# EAGLE schematic EEZ PSU post-regulator r4B45 (EAGLE 6.1)
Assembly variants: Farnell, TME

## Sheet 1 of 3
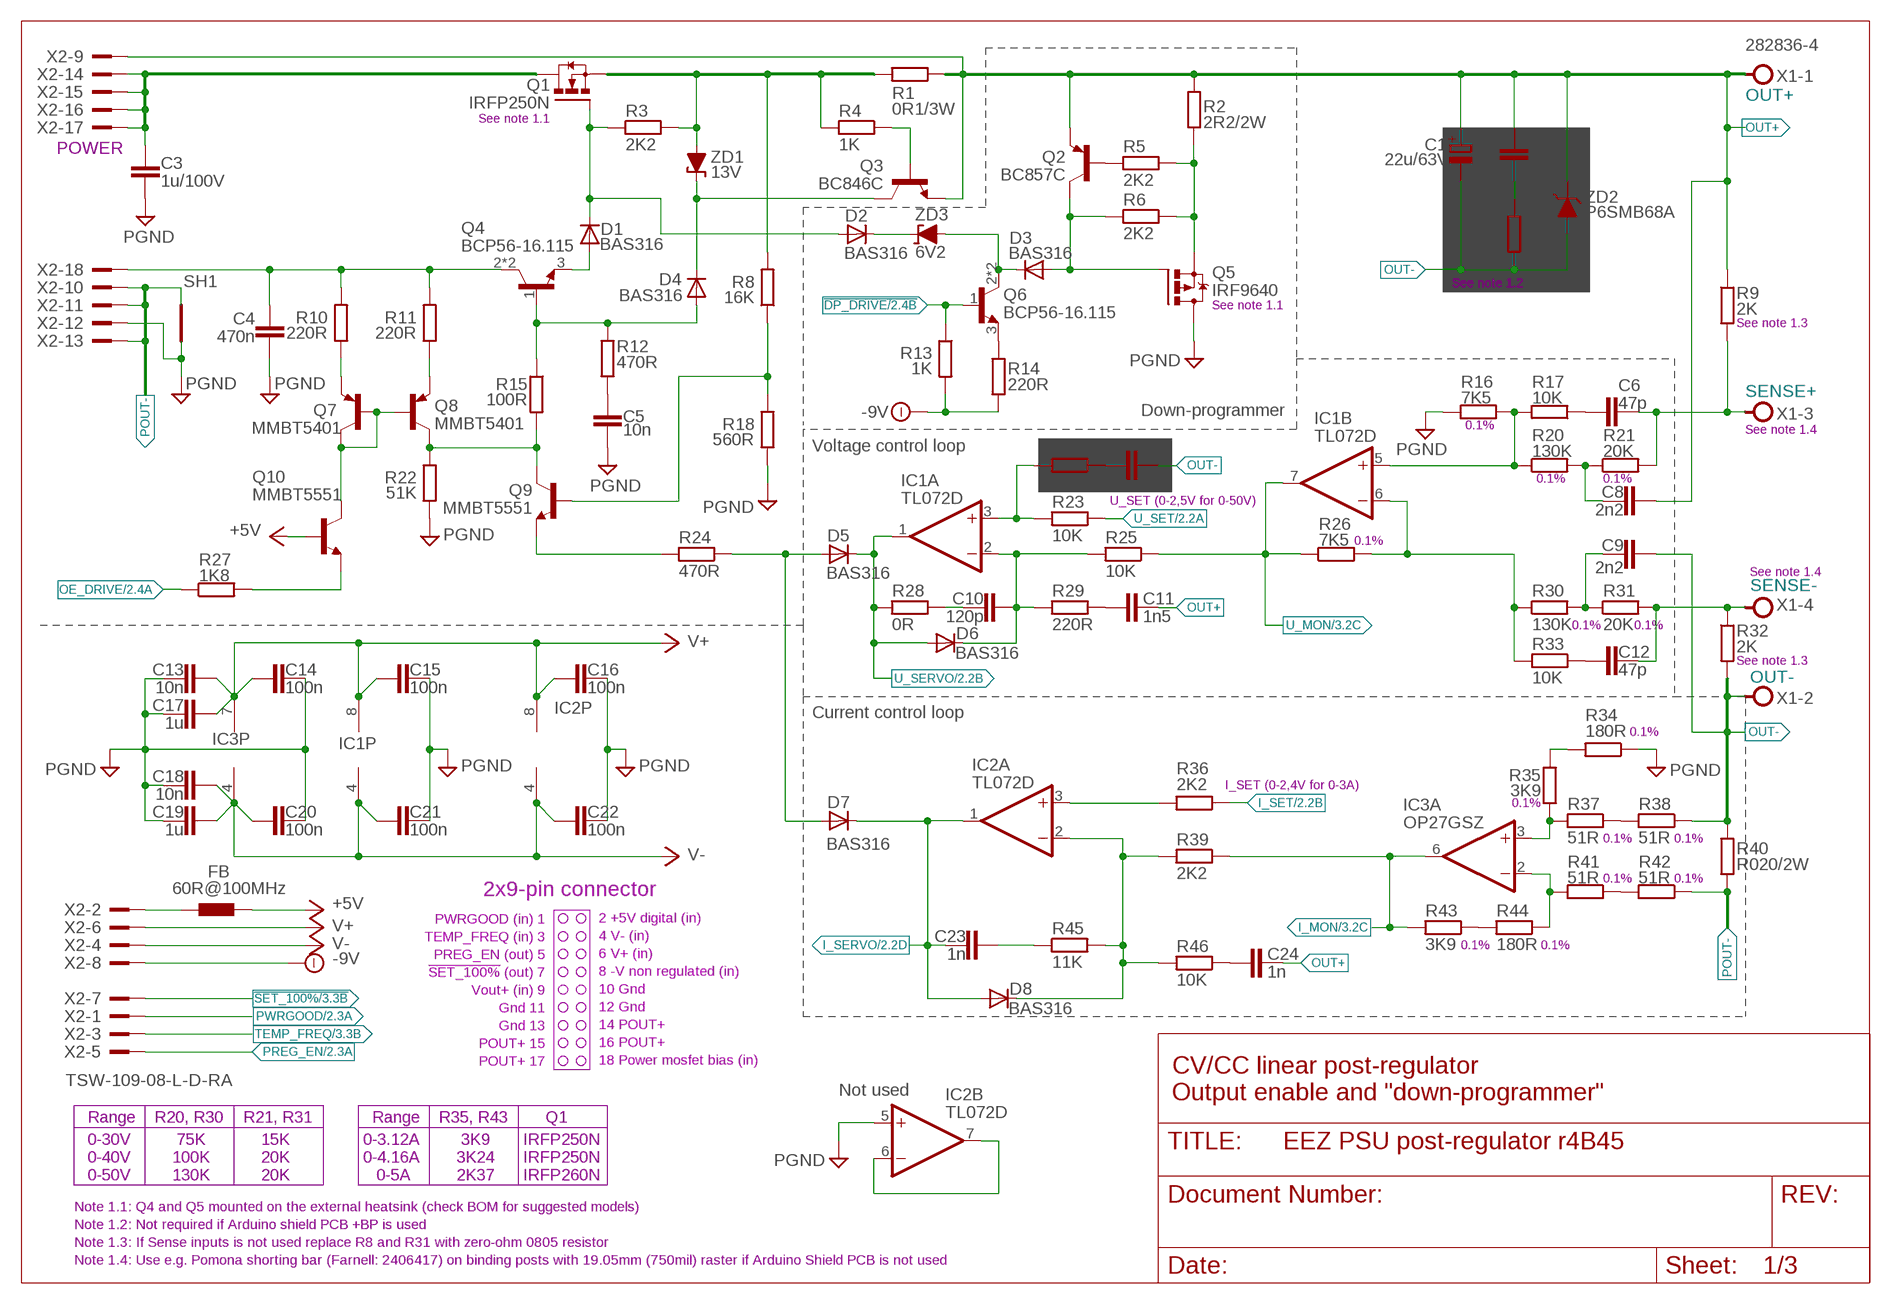
[diagram p0: schematic, sheet 1]

### Parts
C1  22u/63V  ECAPEEEFK+2.5MM  [CAPAE660X610N_COMBO2]
C2  470n  C-EUC1812  [C1812]
C3  1u/100V  C-EUC1206  [C1206]
C4  470n  C-EUC1812  [C1812]
C5  10n  C-EUC0805  [C0805]
C6  47p  C-EUC0805  [C0805]
C7  1n5  C-EUC0805  [C0805]
C8  2n2  C-EUC0805  [C0805]
C9  2n2  C-EUC0805  [C0805]
C10  120p  C-EUC0805  [C0805]
C11  1n5  C-EUC0805  [C0805]
C12  47p  C-EUC0805  [C0805]
C13  10n  C-EUC0805  [C0805]
C14  100n  C-EUC0603  [C0603]
C15  100n  C-EUC0603  [C0603]
C16  100n  C-EUC0603  [C0603]
C17  1u  C-EUC0805  [C0805]
C18  10n  C-EUC0805  [C0805]
C19  1u  C-EUC0805  [C0805]
C20  100n  C-EUC0603  [C0603]
C21  100n  C-EUC0603  [C0603]
C22  100n  C-EUC0603  [C0603]
C23  1n  C-EUC0805  [C0805]
C24  1n  C-EUC0805  [C0805]
D1  BAS316  DIODE-SOD323-W  [SOD323-W]
D2  BAS316  DIODE-SOD323-W  [SOD323-W]
D3  BAS316  DIODE-SOD323-W  [SOD323-W]
D4  BAS316  DIODE-SOD323-W  [SOD323-W]
D5  BAS316  DIODE-SOD323-W  [SOD323-W]
D6  BAS316  DIODE-SOD323-W  [SOD323-W]
D7  BAS316  DIODE-SOD323-W  [SOD323-W]
D8  BAS316  DIODE-SOD323-W  [SOD323-W]
FB  60R@100MHz  FERRITE_BEAD0603  [BEAD0603]
IC1  TL072D  TL072SOIC8  [SOIC127P600X173-8N]
IC2  TL072D  TL072SOIC8  [SOIC127P600X173-8N]
IC3  OP27GSZ  OP27GSZSO8  [SOIC127P600X173-8N]
Q1  IRFP250N  IRFP240  [TO247BV]
Q2  BC857C  BC857C-PNP-SOT23-BEC  [SOT23-BEC]
Q3  BC846C  BC846B-NPN-SOT23-BEC  [SOT23-BEC]
Q4  BCP56-16.115  BCP56  [SOT230P700X180-4N]
Q5  IRF9640  [TO220B-VMOS]
Q6  BCP56-16.115  BCP56  [SOT230P700X180-4N]
Q7  MMBT5401  BC857B-PNP-SOT23-BEC  [SOT23-BEC]
Q8  MMBT5401  BC857B-PNP-SOT23-BEC  [SOT23-BEC]
Q9  MMBT5551  MMBT5551LT1-NPN-SOT23-BEC  [SOT23-BEC]
Q10  MMBT5551  MMBT5551LT1-NPN-SOT23-BEC  [SOT23-BEC]
R1  0R1/3W  R-EU_0411/3V  [0411V]
R2  2R2/2W  R-EU_0411/3V  [0411V]
R3  2K2  R-EU_R0805  [R0805]
R4  1K  R-EU_R0805  [R0805]
R5  2K2  R-EU_R0805  [R0805]
R6  2K2  R-EU_R0805  [R0805]
R7  1R  R-EU_R0805  [R0805]
R8  16K  R-EU_R0805  [R0805]
R9  2K  R-EU_R0805  [R0805]
R10  220R  R-EU_R0805  [R0805]
R11  220R  R-EU_R0805  [R0805]
R12  470R  R-EU_R0805  [R0805]
R13  1K  R-EU_R0805  [R0805]
R14  220R  R-EU_R0805  [R0805]
R15  100R  R-EU_R0805  [R0805]
R16  7K5  R-EU_R0805  [R0805]
R17  10K  R-EU_R0805  [R0805]
R18  560R  R-EU_R0805  [R0805]
R19  220R  R-EU_R0805  [R0805]
R20  130K  R-EU_R0805  [R0805]
R21  20K  R-EU_R0805  [R0805]
R22  51K  R-EU_R0805  [R0805]
R23  10K  R-EU_R0805  [R0805]
R24  470R  R-EU_R0805  [R0805]
R25  10K  R-EU_R0805  [R0805]
R26  7K5  R-EU_R0805  [R0805]
R27  1K8  R-EU_R0805  [R0805]
R28  0R  R-EU_R0805  [R0805]
R29  220R  R-EU_R0805  [R0805]
R30  130K  R-EU_R0805  [R0805]
R31  20K  R-EU_R0805  [R0805]
R32  2K  R-EU_R0805  [R0805]
R33  10K  R-EU_R0805  [R0805]
R34  180R  R-EU_R0805  [R0805]
R35  3K9  R-EU_R0805  [R0805]
R36  2K2  R-EU_R0805  [R0805]
R37  51R  R-EU_R0805  [R0805]
R38  51R  R-EU_R0805  [R0805]
R39  2K2  R-EU_R0805  [R0805]
R40  R020/2W  R-EU_R2512  [R2512]
R41  51R  R-EU_R0805  [R0805]
R42  51R  R-EU_R0805  [R0805]
R43  3K9  R-EU_R0805  [R0805]
R44  180R  R-EU_R0805  [R0805]
R45  11K  R-EU_R0805  [R0805]
R46  10K  R-EU_R0805  [R0805]
SH1  GND  SHORT  [SHORT]
X1  282836-4  TBLOCK5.0_4A  [TBLOCK5.0_4]
X2  TSW-109-08-L-D-RA  [TSW-109-08-L-D-RA]
ZD1  13V  ZENER-DIODEMINIMELF  [MINIMELF]
ZD2  P6SMB68A  [DO214AA]
ZD3  6V2  ZENER-DIODEMINIMELF  [MINIMELF]

### Nets
!DP_DRIVE: Q6.1(B) R13.1 ; also sheet 2
!SET_100%: X2.7 ; also sheet 3
+5V: FB.P$2 Q10.B ; also sheet 2,3
-9V: R13.2 R14.2 X2.8
DC_IN: C3.1 Q1.D X2.14 X2.15 X2.16 X2.17
GND [gnd]: C3.2 C4.2 C5.2 C13.1 C14.2 C15.1 C16.1 C17.1 C18.1 C19.1 C20.2 C21.1 C22.1 IC2.5(B:+IN) Q5.D R16.1 R18.1 R22.1 R34.1 SH1.1(GND_A) X2.12 ; supply symbol labelled PGND ; also sheet 2,3
I_MON: IC3.6(A:OUT) R39.1 R43.2 ; also sheet 3
I_SERVO: C23.2 D7.C D8.A IC2.1(A:OUT) ; also sheet 2
I_SET: R36.1 ; also sheet 2
ISENSE+: IC3.3(A:+IN) R35.2 R37.2
ISENSE-: IC3.2(A:-IN) R41.2 R44.1
N$1: Q6.3(E) R14.1
N$2: Q2.B R5.2
N$3: C6.2 R17.1
N$8: R37.1 R38.2
N$10: C12.2 R33.1
N$12: FB.P$1 X2.2
N$13: R41.1 R42.2
N$14: R43.1 R44.2
N$15: R34.2 R35.1
N$16: IC2.6(B:-IN) IC2.7(B:OUT)
N$17: C9.1 R30.2 R31.1
N$18: C10.2 R28.1
N$22: C24.2 R46.1
N$26: C7.2 R19.1
N$27: C11.2 R29.1
N$29: IC1.3(A:+IN) R19.2 R23.2
N$32: C10.1 D6.C IC1.2(A:-IN) R25.2 R29.2
N$37: D8.C IC2.2(A:-IN) R39.2 R45.2 R46.2
N$44: Q9.B R8.1 R18.2
N$50: IC2.3(A:+IN) R36.2
N$54: D5.A D7.A R24.1
N$56: D1.C D2.A Q1.G R3.1
N$62: D1.A Q4.3(E)
N$65: D4.A Q4.1(B) R12.2 R15.1
N$67: C5.1 R12.1
N$117: C8.1 R20.2 R21.1
N$129: D4.C Q3.C ZD1.C
N$143: D2.C ZD3.C
N$145: Q9.E R24.2
N$146: Q5.S R2.1 R5.1 R6.1
N$147: D3.A Q2.C Q5.G R6.2
N$149: C2.2 R7.2
N$150: IC1.5(B:+IN) R16.2 R17.2 R20.1
N$158: IC1.6(B:-IN) R26.2 R30.1 R33.2
N$172: C23.1 R45.1
N$183: Q8.E R11.1
N$184: Q7.E R10.1
N$186: Q10.E R27.2
N$201: Q3.B R4.1
OE_DRIVE: R27.1 ; also sheet 2
OUT+: C1.1(+) C1.1.1(+) C2.1 C8.2 C11.1 C24.1 Q2.E Q3.E R1.1 R2.2 R9.1 X1.P$1 X2.9 ZD2.C
OUT-: C1.2(-) C1.2.1(-) C7.1 C9.2 R7.1 R32.2 R38.1 R40.1 X1.P$2 ZD2.A
POUT-: R40.2 R42.1 SH1.2(GND_B) X2.10 X2.11 X2.13
PREG_EN: X2.5 ; also sheet 2
PWRGOOD: X2.1 ; also sheet 2,3
Q4_OUT: Q1.S R1.2 R3.2 R4.2 R8.2 ZD1.A
Q6C: D3.C Q6.2(C) Q6.4(C) ZD3.A
Q7C: Q7.B Q7.C Q8.B Q10.C
Q8C: Q8.C Q9.C R15.2 R22.2
SENSE+: C6.1 R9.2 R21.2 X1.P$3
SENSE-: C12.1 R31.2 R32.1 X1.P$4
TEMP_FREQ: X2.3 ; also sheet 3
U_MON: IC1.7(B:OUT) R25.1 R26.1 ; also sheet 3
U_SERVO: D5.C D6.A IC1.1(A:OUT) R28.2 ; also sheet 2
U_SET: R23.1 ; also sheet 2
V+: C13.2 C14.1 C15.2 C16.2 C17.2 IC1.8(P:V+) IC2.8(P:V+) IC3.7(P:V+) X2.6 ; also sheet 2
V-: C18.2 C19.2 C20.1 C21.2 C22.2 IC1.4(P:V-) IC2.4(P:V-) IC3.4(P:V-) X2.4 ; also sheet 2
VBIAS: C4.1 Q4.2(C) Q4.4(C) R10.2 R11.2 X2.18

### Notes on the sheet
- See note 1.1
- POWER
- See note 1.2
- See note 1.1
- See note 1.3
- Down-programmer
- 0.1%
- See note 1.4
- Voltage control loop
- 0.1% | 0.1%
- U_SET (0-2,5V for 0-50V)
- 0.1%
- See note 1.4
- 0.1% | 0.1%
- See note 1.3
- Current control loop
- 0.1%
- I_SET (0-2,4V for 0-3A)
- 0.1%
- 0.1% | 0.1%
- 0.1% | 0.1%
- 2x9-pin connector
- PWRGOOD (in) 1
- 2 +5V digital (in)
- TEMP_FREQ (in) 3
- 4 V- (in)
- PREG_EN (out) 5 | 0.1% | 0.1%
- 6 V+ (in)
- !SET_100%! (out) 7
- 8 -V non regulated (in)
- Vout+ (in) 9
- 10 Gnd
- Gnd 11
- 12 Gnd
- Gnd 13
- 14 POUT+
- POUT+ 15
- 16 POUT+
- POUT+ 17
- 18 Power mosfet bias (in)
- CV/CC linear post-regulator
- Not used | Output enable and "down-programmer"
- Range | R20, R30 | R21, R31 | Range | R35, R43 | Q1
- 0-30V | 75K | 15K | 0-3.12A | 3K9 | IRFP250N
- 0-40V | 100K | 20K | 0-4.16A | 3K24 | IRFP250N
- 0-50V | 130K | 20K | 0-5A | 2K37 | IRFP260N
- Note 1.1: Q4 and Q5 mounted on the external heatsink (check BOM for suggested models)
- Note 1.2: Not required if Arduino shield PCB +BP is used
- Note 1.3: If Sense inputs is not used replace R8 and R31 with zero-ohm 0805 resistor
- Note 1.4: Use e.g. Pomona shorting bar (Farnell: 2406417) on binding posts with 19.05mm (750mil) raster if Arduino Shield PCB is not used

## Sheet 2 of 3
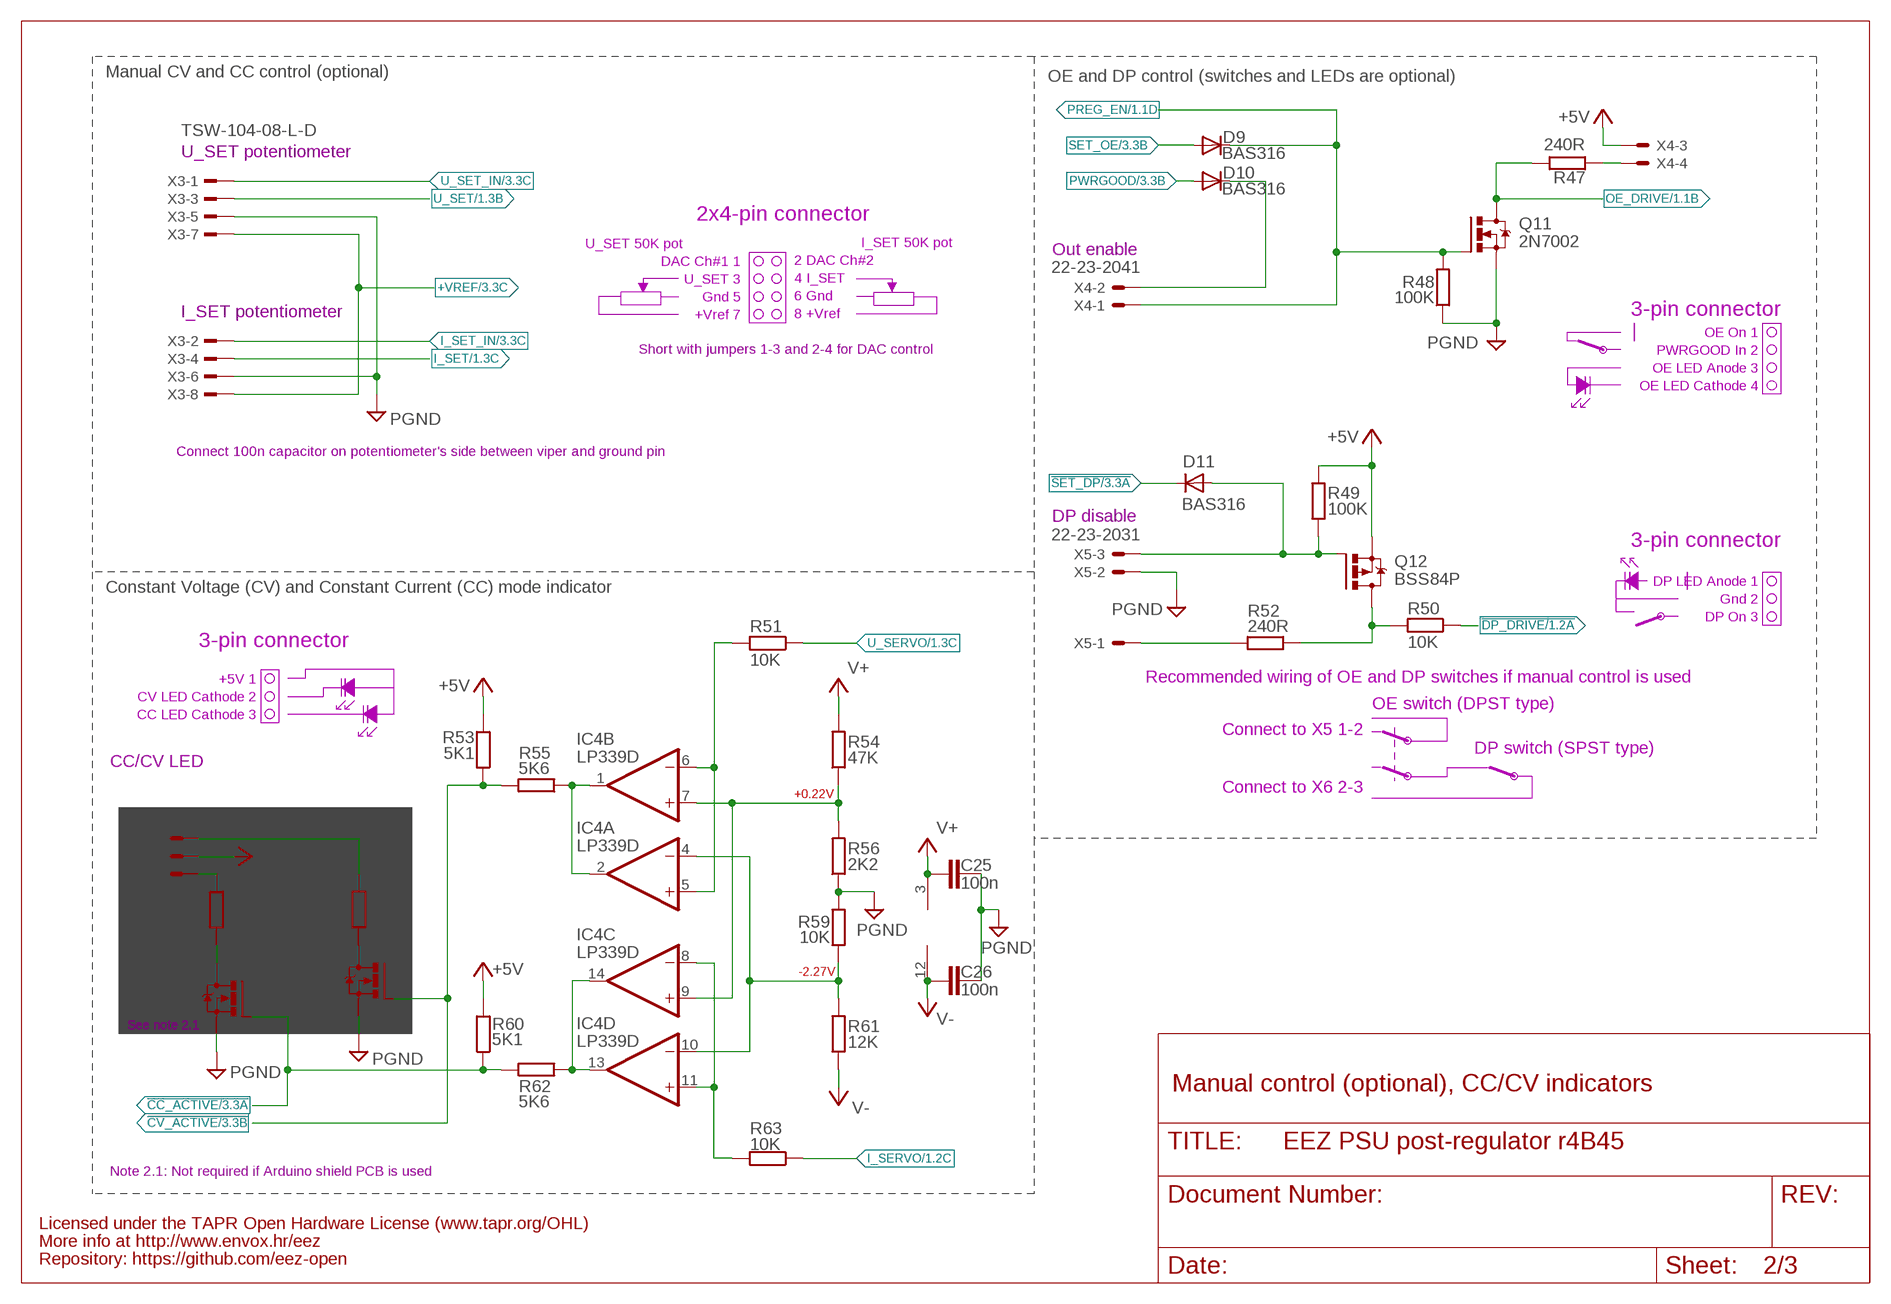
[diagram p1: schematic, sheet 2]

### Parts
C25  100n  C-EUC0603  [C0603]
C26  100n  C-EUC0603  [C0603]
D9  BAS316  DIODE-SOD323-W  [SOD323-W]
D10  BAS316  DIODE-SOD323-W  [SOD323-W]
D11  BAS316  DIODE-SOD323-W  [SOD323-W]
IC4  LP339D  LM339D  [SO14]
Q11  2N7002  [SOT103P240X110-3N]
Q12  BSS84P  IRLML2246TRPBF  [SOT95P237X112-3N]
Q13  2N7002  [SOT103P240X110-3N]
Q14  2N7002  [SOT103P240X110-3N]
R47  240R  R-EU_R0805  [R0805]
R48  100K  R-EU_R0805  [R0805]
R49  100K  R-EU_R0805  [R0805]
R50  10K  R-EU_R0805  [R0805]
R51  10K  R-EU_R0805  [R0805]
R52  240R  R-EU_R0805  [R0805]
R53  5K1  R-EU_R0805  [R0805]
R54  47K  R-EU_R0805  [R0805]
R55  5K6  R-EU_R0805  [R0805]
R56  2K2  R-EU_R0805  [R0805]
R57  240R  R-EU_R0805  [R0805]
R58  240R  R-EU_R0805  [R0805]
R59  10K  R-EU_R0805  [R0805]
R60  5K1  R-EU_R0805  [R0805]
R61  12K  R-EU_R0805  [R0805]
R62  5K6  R-EU_R0805  [R0805]
R63  10K  R-EU_R0805  [R0805]
X3  TSW-104-08-L-D  TSW-104-02-S-D  [TSW-104-02-S-D]
X4  22-23-2041  [22-23-2041]
X5  22-23-2031  [22-23-2031]
X6  22-23-2031  [22-23-2031]

### Nets
!CC_ACTIVE: Q14.1(G) R60.1 R62.2 ; also sheet 3
!CV_ACTIVE: Q13.1(G) R53.1 R55.2 ; also sheet 3
!DP_DRIVE: R50.1 ; also sheet 1
!SET_DP: D11.C ; also sheet 3
+5V: Q12.2(S) R49.1 R53.2 R60.2 X4.3 X6.2 ; also sheet 1,3
+VREF: X3.7 X3.8 ; also sheet 3
CC_LED: R57.2 X6.1
CV_LED: R58.1 X6.3
DP_LED: Q12.3(D) R50.2 R52.2
GND [gnd]: C25.1 C26.1 Q11.2(S) Q13.2(S) Q14.2(S) R48.1 R56.1 R59.2 X3.5 X3.6 X5.2 ; supply symbol labelled PGND ; also sheet 1,3
I_SERVO: R63.1 ; also sheet 1
I_SET: X3.4 ; also sheet 1
I_SET_IN: X3.2 ; also sheet 3
N$4: D10.C X4.2
N$5: R52.1 X5.1
N$6: D11.A Q12.1(G) R49.2 X5.3
N$7: Q13.3(D) R58.2
N$9: R47.1 X4.4
N$28: Q14.3(D) R57.1
N$45: IC4.1(B:OUT) IC4.2(A:OUT) R55.1
N$48: IC4.13(D:OUT) IC4.14(C:OUT) R62.1
N$153: IC4.5(A:+IN) IC4.6(B:-IN) R51.2
N$161: IC4.8(C:-IN) IC4.11(D:+IN) R63.2
N$170: IC4.7(B:+IN) IC4.9(C:+IN) R54.1 R56.2
N$177: IC4.4(A:-IN) IC4.10(D:-IN) R59.1 R61.2
OE_DRIVE: Q11.3(D) R47.2 ; also sheet 1
PREG_EN: D9.C Q11.1(G) R48.2 X4.1 ; also sheet 1
PWRGOOD: D10.A ; also sheet 1,3
SET_OE: D9.A ; also sheet 3
U_SERVO: R51.1 ; also sheet 1
U_SET: X3.3 ; also sheet 1
U_SET_IN: X3.1 ; also sheet 3
V+: C25.2 IC4.3(P:V+) R54.2 ; also sheet 1
V-: C26.2 IC4.12(P:GND) R61.1 ; also sheet 1

### Notes on the sheet
- Manual CV and CC control (optional) | OE and DP control (switches and LEDs are optional)
- U_SET potentiometer
- 2x4-pin connector
- U_SET 50K pot
- Out enable
- I_SET 50K pot
- DAC Ch#1 1
- 2 DAC Ch#2
- U_SET 3
- 4 I_SET
- Gnd 5
- 6 Gnd | 3-pin connector
- I_SET potentiometer
- +Vref 7
- 8 +Vref
- OE On 1
- PWRGOOD In 2
- Short with jumpers 1-3 and 2-4 for DAC control
- OE LED Anode 3
- OE LED Cathode 4
- Connect 100n capacitor on potentiometer's side between viper and ground pin
- DP disable
- 3-pin connector
- DP LED Anode 1
- Constant Voltage (CV) and Constant Current (CC) mode indicator
- Gnd 2
- DP On 3
- 3-pin connector
- +5V 1
- Recommended wiring of OE and DP switches if manual control is used
- CV LED Cathode 2
- CC LED Cathode 3 | OE switch (DPST type)
- Connect to X5 1-2
- DP switch (SPST type)
- CC/CV LED
- Connect to X6 2-3
- +0.22V
- -2.27V
- See note 2.1
- Manual control (optional), CC/CV indicators
- Note 2.1: Not required if Arduino shield PCB is used
- Licensed under the TAPR Open Hardware License (www.tapr.org/OHL)
- More info at http://www.envox.hr/eez
- Repository: https://github.com/eez-open

## Sheet 3 of 3
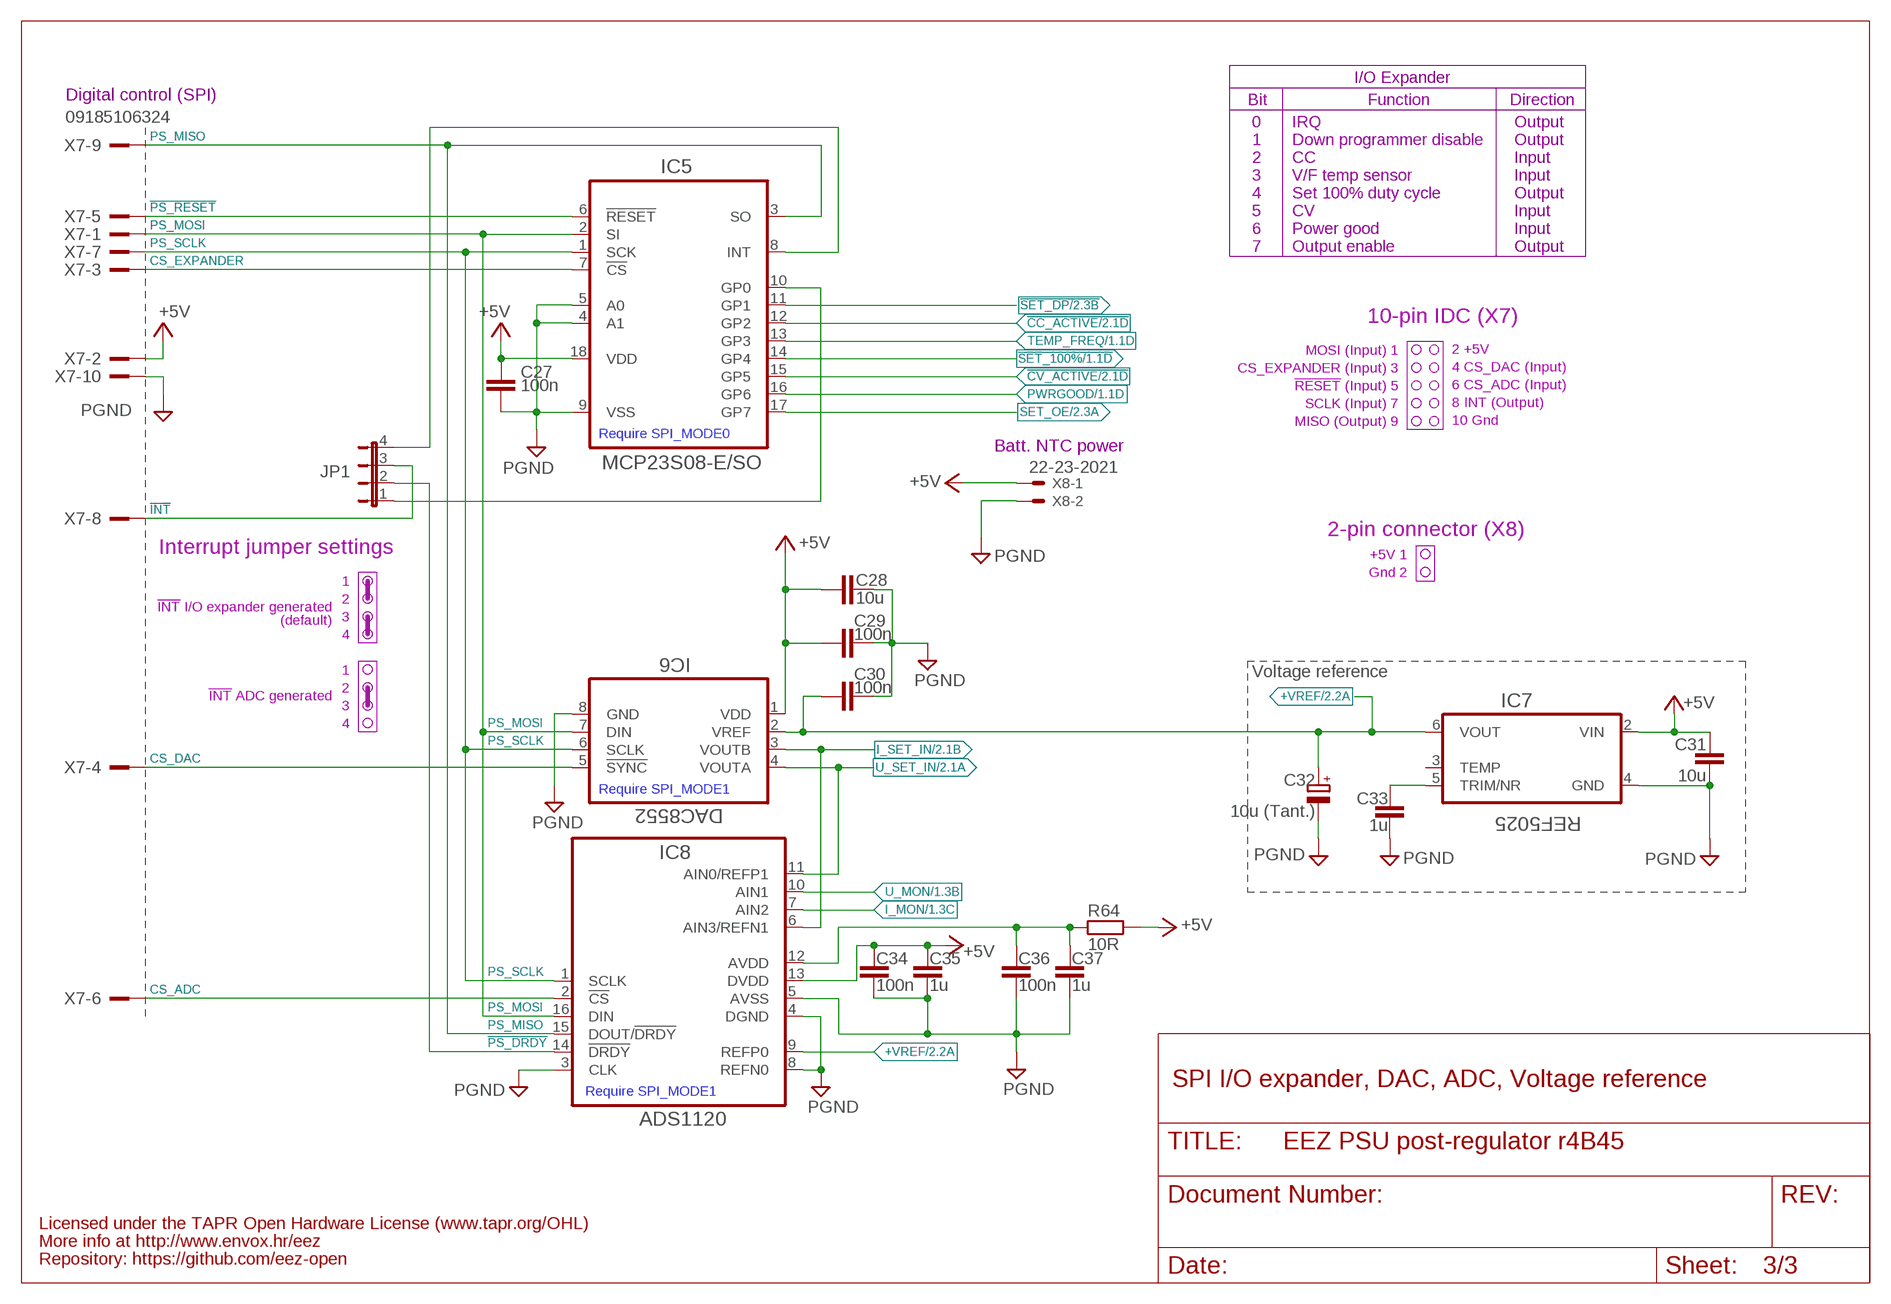
[diagram p2: schematic, sheet 3]

### Parts
C27  100n  C-EUC0603  [C0603]
C28  10u  C-EUC1206  [C1206]
C29  100n  C-EUC0603  [C0603]
C30  100n  C-EUC0603  [C0603]
C31  10u  C-EUC1206  [C1206]
C32  10u (Tant.)  ECAP1206  [EC1206]
C33  1u  C-EUC0805  [C0805]
C34  100n  C-EUC0603  [C0603]
C35  1u  C-EUC0805  [C0805]
C36  100n  C-EUC0603  [C0603]
C37  1u  C-EUC0805  [C0805]
IC5  MCP23S08-E/SO  MCP23S08  [SOIC127P1030X265-18N]
IC6  DAC8552  DAC8552_DGK_8M  [DGK8-M]
IC7  REF5025  REF50XX  [SOIC127P600X175-8N]
IC8  ADS1120  ADS1120TSSOP-16  [PW(R-PDSO-G16)]
JP1  JP4E  [JP4]
R64  10R  R-EU_R0805  [R0805]
X7  09185106324  2510-  [PAK100/2500-10]
X8  22-23-2021  [22-23-2021]

### Nets
!CC_ACTIVE: IC5.12(GP2) ; also sheet 2
!CV_ACTIVE: IC5.15(GP5) ; also sheet 2
!INT: JP1.3 X7.8
!PS_DRDY: IC8.14(!DRDY) JP1.2
!PS_RESET: IC5.6(!RESET) X7.5
!SET_100%: IC5.14(GP4) ; also sheet 1
!SET_DP: IC5.11(GP1) ; also sheet 2
+5V: C27.1 C28.1 C29.2 C31.1 C34.2 C35.2 IC5.18(VDD) IC6.1(VDD) IC7.2(VIN) IC8.13(DVDD) R64.1 X7.2 X8.1 ; also sheet 1,2
+VREF: C30.2 C32.+ IC6.2(VREF) IC7.6(VOUT) IC8.9(REFP0) ; also sheet 2
CS_ADC: IC8.2(!CS) X7.6
CS_DAC: IC6.5(!SYNC) X7.4
CS_EXPANDER: IC5.7(!CS) X7.3
GND [gnd]: C27.2 C28.2 C29.1 C30.1 C31.2 C32.- C33.2 C34.1 C35.1 C36.1 C37.1 IC5.4(A1) IC5.5(A0) IC5.9(VSS) IC6.8(GND) IC7.4(GND) IC8.3(CLK) IC8.4(DGND) IC8.5(AVSS) IC8.8(REFN0) X7.10 X8.2 ; supply symbol labelled PGND ; also sheet 1,2
I_MON: IC8.7(AIN2) ; also sheet 1
I_SET_IN: IC6.3(VOUTB) IC8.6(AIN3/REFN1) ; also sheet 2
INT_EXP: IC5.8(INT) JP1.4
N$11: C33.1 IC7.5(TRIM/NR)
N$42: C36.2 C37.2 IC8.12(AVDD) R64.2
N$63: IC5.10(GP0) JP1.1
PS_MISO: IC5.3(SO) IC8.15(DOUT/!DRDY) X7.9
PS_MOSI: IC5.2(SI) IC6.7(DIN) IC8.16(DIN) X7.1
PS_SCLK: IC5.1(SCK) IC6.6(SCLK) IC8.1(SCLK) X7.7
PWRGOOD: IC5.16(GP6) ; also sheet 1,2
SET_OE: IC5.17(GP7) ; also sheet 2
TEMP_FREQ: IC5.13(GP3) ; also sheet 1
U_MON: IC8.10(AIN1) ; also sheet 1
U_SET_IN: IC6.4(VOUTA) IC8.11(AIN0/REFP1) ; also sheet 2
Unconnected: IC7.3(TEMP)

### Notes on the sheet
- I/O Expander
- Digital control (SPI) | Bit | Function | Direction
- 0 | IRQ | Output
- 1 | Down programmer disable | Output
- 2 | CC | Input
- 3 | V/F temp sensor | Input
- 4 | Set 100% duty cycle | Output
- 5 | CV | Input
- 6 | Power good | Input
- 7 | Output enable | Output
- 10-pin IDC (X7)
- MOSI (Input) 1
- 2 +5V
- CS_EXPANDER (Input) 3
- 4 CS_DAC (Input)
- !RESET! (Input) 5
- 6 CS_ADC (Input)
- SCLK (Input) 7
- 8 INT (Output)
- MISO (Output) 9
- 10 Gnd
- Require SPI_MODE0
- Batt. NTC power
- 2-pin connector (X8)
- +5V 1
- Interrupt jumper settings
- Gnd 2
- 1
- 2
- !INT! I/O expander generated | 3
- (default)
- 4
- 1 | Voltage reference
- 2
- !INT! ADC generated | 3
- 4
- Require SPI_MODE1
- SPI I/O expander, DAC, ADC, Voltage reference
- Require SPI_MODE1
- Licensed under the TAPR Open Hardware License (www.tapr.org/OHL)
- More info at http://www.envox.hr/eez
- Repository: https://github.com/eez-open

## Library data of the parts
C1 C32 = EEZ_Lib1:ECAP
C2-C31 C33-C37 = rcl:C-EU: CAPACITOR, European symbol
D1-D11 = diode:DIODE-: DIODE
FB = EEZ_Lib1:FERRITE_BEAD: FAIR-RITE - 2506033007Y3 - FERRITE BEAD, 0.04OHM, 3A, 0603 Farnell: 2112873
IC1 IC2 = EEZ_Lib1:TL072
IC3 = EEZ_Lib1:OP27GSZ: Low Noise, Precision Operational Amplifier
IC4 = linear:LM339: Low Power Low Offset Voltage Quad Comparators with open collector; LM139/LM239/LM339/LM2901/LM3302
IC5 = EEZ_Lib1:MCP23S08: 8-Bit I/O Expander with SPI; DESCRIPTION: IC I/O EXPANDER; MPN: MCP23S08-E/SO; OC_FARNELL: 1332092; OC_NEWARK: 08J8733; PACKAGE: SOIC-18; SUPPLIER: Microchip
IC6 = EEZ_Lib1:DAC8552_DGK_8
IC7 = EEZ_Lib1:REF50XX: Low-Noise (3μVpp/V), Very Low Drift (max. 8ppm/°C), Precision Voltage Reference Pin compatible with REF2 Farnell: 1439628
IC8 = EEZ_Lib1:ADS1120: Low-Power, Low-Noise, 16-Bit, Analog-to-Digital Converter for Small-Signal Sensors Farnell: 2402249
JP1 = jumper:JP4E: JUMPER
Q1 = EEZ_Lib1:IRFP240: HEXFET Power MosFet Source: http://www.irf.com/
Q2 Q7 Q8 = transistor:*-PNP-: PNP Transistror
Q3 Q9 Q10 = transistor:*-NPN-: NPN Transistror BF959 corrected 2008.03.06
Q4 Q6 = EEZ_Lib1:BCP56: Low power NPN Transistor, Vceo=80V, Ic=1A, SOT-223
Q5 = EEZ_Lib1:IRF9640: P-ch MOSFET, 11 A, 200 V, 500 mohm, -10 V, -4 V; FARNELL: 8648654; TME: IRF9640PBF
Q11 Q13 Q14 = EEZ_Lib1:2N7002: N-CHANNEL ENHANCEMENT MODE FIELD EFFECT TRANSISTOR; MPN: 2N7002-7-F; OC_FARNELL: 1713823; OC_NEWARK: 25R5679; PACKAGE: SOT-23-3; SUPPLIER: DIODES INC.
Q12 = EEZ_Lib1:IRLML2246TRPBF: HEXFET Power MOSFET (-20V, -2.6A); MPN: IRLML2246TRPBF; OC_FARNELL: 1888166; OC_NEWARK: 40T7450; PACKAGE: SOT-3; SUPPLIER: International Rectifier; TME: IRLML2246TRPBF
R1-R64 = rcl:R-EU_: RESISTOR, European symbol
SH1 = EEZ_Lib1:SHORT
X1 = EEZ_Lib1:TBLOCK5.0_4A
X2 = EEZ_Lib1:TSW-109-08-L-D-RA: Samtec TSW-109-08-L-D-RA Header, 2.54MM, THT, R/A, 18-way; FARNELL: 2032801
X3 = EEZ_Lib1:TSW-104-02-S-D: THROUGH-HOLE .025" SQ POST HEADER Source: Samtec TSW.pdf
X4 = con-molex:22-23-2041: .100" (2.54mm) Center Header - 4 Pin; MF: MOLEX; MPN: 22-23-2041; OC_FARNELL: 1462920; OC_NEWARK: 38C0355
X5 X6 = con-molex:22-23-2031: .100" (2.54mm) Center Header - 3 Pin; MF: MOLEX; MPN: 22-23-2031; OC_FARNELL: 1462950; OC_NEWARK: 30C0862
X7 = con-3m:2510-: 3M (TM) Pak 100 4-Wall Header Source: 3M; MF: 3M; MPN: 2510-6002UB; OC_FARNELL: 9838244; OC_NEWARK: 46F4725
X8 = con-molex:22-23-2021: .100" (2.54mm) Center Header - 2 Pin; MF: MOLEX; MPN: 22-23-2021; OC_FARNELL: 1462926; OC_NEWARK: 25C3832
ZD1 ZD3 = EEZ_Lib1:ZENER-DIODE
ZD2 = EEZ_Lib1:P6SMB68A: Transient Voltage Suppression Diodes, DO-214AA

## Net classes
0 default: width 0.254 mm, drill 0.584 mm, clearance 0.254 mm
1 dgnd: width 0.254 mm, drill 0.584 mm, clearance 0.254 mm
2 gnd: width 0.254 mm, drill 0.584 mm, clearance 0.254 mm